# EAGLE design untitled (EAGLE 9.6.2)
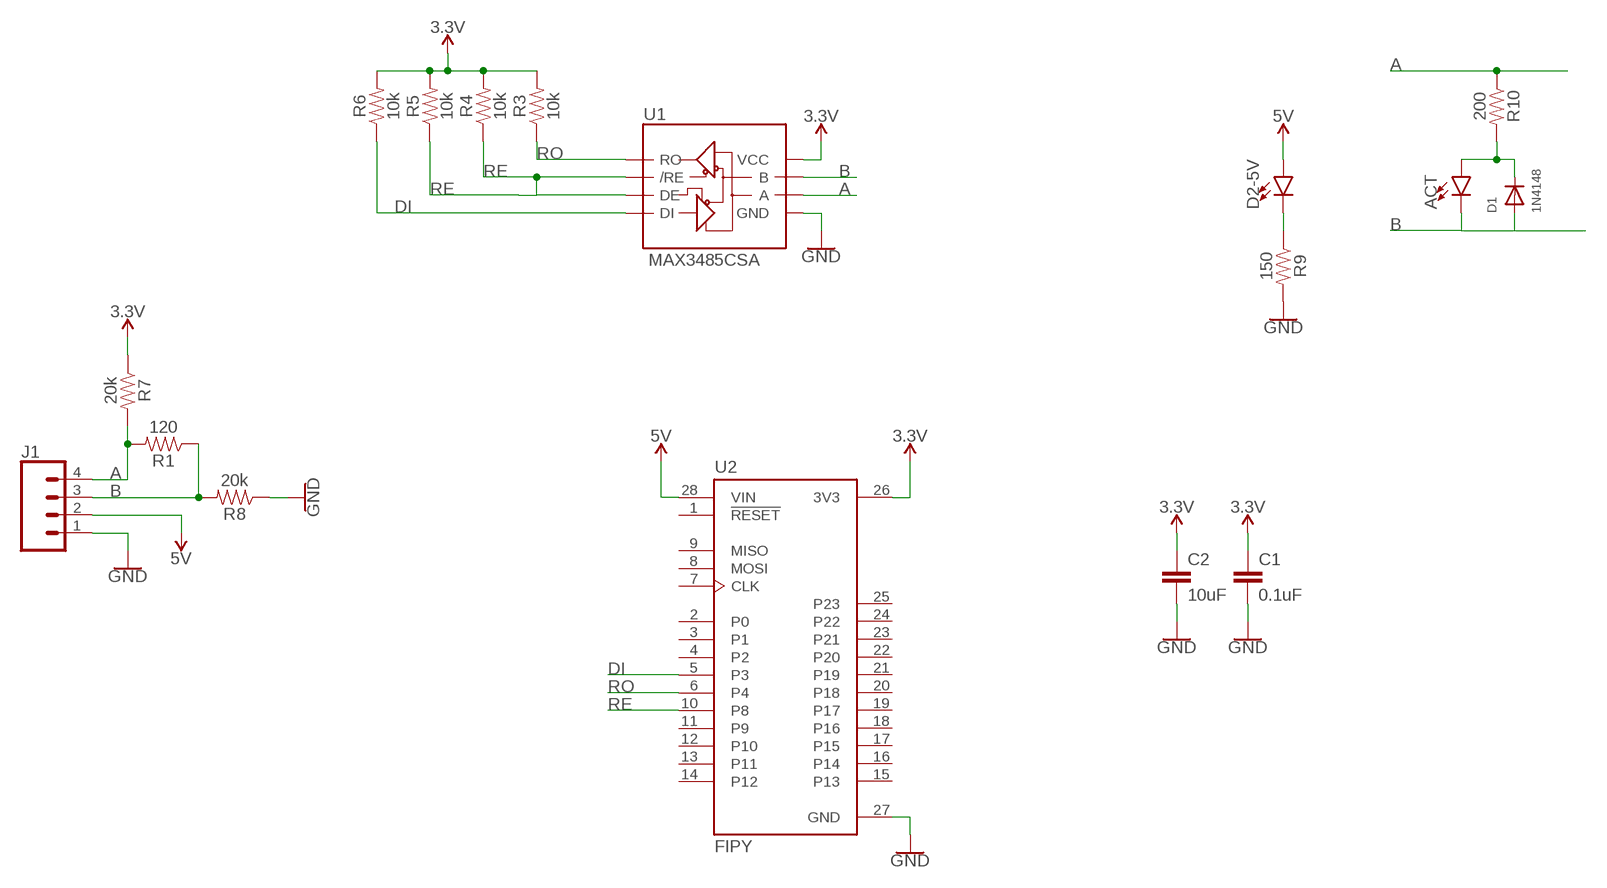
[diagram p0: schematic, sheet 1]

## Parts
ACT  LED0603  [LED-0603]
C1  0.1uF  0.1UF-0603-25V-5%  [0603]
C2  10uF  10UF-0603-6.3V-20%  [0603]
D1  1N4148  DIODESOD-123  [SOD-123]
D2-5V  LED0603  [LED-0603]
J1  CONN_04LOCK_LONGPADS  [1X04_LOCK_LONGPADS]
R1  120  0.3OHM-0805-1/8W-1%  [0805]
R3  10k  10KOHM-0603-1/10W-1%  [0603]
R4  10k  10KOHM-0603-1/10W-1%  [0603]
R5  10k  10KOHM-0603-1/10W-1%  [0603]
R6  10k  10KOHM-0603-1/10W-1%  [0603]
R7  20k  0.3OHM-0805-1/8W-1%  [0805]
R8  20k  0.3OHM-0805-1/8W-1%  [0805]
R9  150  0.3OHM-0805-1/8W-1%  [0805]
R10  200  0.3OHM-0805-1/8W-1%  [0805]
U1  MAX3485CSA  RS485SOIC  [SO08]
U2  FIPY  [MODULE_FIPY]

## Nets
3.3V: C1.1 C2.1 R3.2 R4.2 R5.2 R6.2 R7.1 U1.8(VCC) U2.26(3V3)
5V: D2-5V.A J1.2 U2.28(VIN)
A: J1.4 R1.2 R7.2 R10.1 U1.6(A)
B: ACT.C D1.A J1.3 R1.1 R8.2 U1.7(B)
DI: R6.1 U1.4(DI) U2.5(P3)
GND: C1.2 C2.2 J1.1 R8.1 R9.2 U1.5(GND) U2.27(GND)
N$2: D2-5V.C R9.1
N$4: ACT.A D1.C R10.2
RE: R4.1 R5.1 U1.2(/RE) U1.3(DE) U2.10(P8)
RO: R3.1 U1.1(RO) U2.6(P4)
Unconnected: U2.1(!RESET) U2.2(P0) U2.3(P1) U2.4(P2) U2.7(CLK) U2.8(MOSI) U2.9(MISO) U2.11(P9) U2.12(P10) U2.13(P11) U2.14(P12) U2.15(P13) U2.16(P14) U2.17(P15) U2.18(P16) U2.19(P17) U2.20(P18) U2.21(P19) U2.22(P20) U2.23(P21) U2.24(P22) U2.25(P23)

## Library data of the parts
ACT D2-5V = SparkFun-LED:LED: LED (Generic) Standard schematic elements and footprints for 5mm, 3mm, 1206, and 0603 sized LEDs. Generic LEDs with no color specified.
C1 = SparkFun-Capacitors:0.1UF: 0.1µF ceramic capacitors A capacitor is a passive two-terminal electrical component used to store electrical energy temporarily in an electric field.; PROD_ID: CAP-08604
C2 = SparkFun-Capacitors:10UF: 10.0µF ceramic capacitors A capacitor is a passive two-terminal electrical component used to store electrical energy temporarily in an electric field.; PROD_ID: CAP-11015
D1 = adafruit:DIODE: Diode SMADIODE - SMA Surface Mount Package 20V 1A Schottky Diode Digikey: 641-1014-6-ND DO-1N4148 - Through Hole Small Current Diode SOD-123 20V 1 A (.5mV Vf) Schottky Diode - Digikey: MBRX120TPMSCT-ND SOD-323 10V 570mA (.38mV Vf, 3ns) Schottky Diode - Digikey: ZLLS410CT-ND SOD-523 30V 30mA Schottky Diode (RB751S-40TE61) - Digikey: RB751S-40TE61CT-ND SOT23-R/W - SOT23 Package (R = Solder Paste/Reflow Ovens, W = Hand-Soldering) BAT54Film 40V 300mA - Digikey: 497-7162-1-ND
J1 = SparkFun-Connectors:CONN_04: Multi connection point. Often used as Generic Header-pin footprint for 0.1 inch spaced/style header connections On any of the 0.1 inch spaced packages, you can populate with these: Break Away Headers - Straight <https://www.sparkfun.com/products/116> (PRT-00116) Break Away Male Headers - Right Angle <https://www.sparkfun.com/products/553> (PRT-00553) Female Headers <https://www.sparkfun.com/products/115> (PRT-00115) Break Away Headers - Machine Pin <https://www.sparkfun.com/products/117> (PRT-00117) Break Away Female Headers - Swiss Machine Pin <https://www.sparkfun.com/products/743> (PRT-00743) For SCREWTERMINALS and SPRING TERMINALS visit here: Screw Terimnals on SparkFun.com <https://www.sparkfun.com/search/results?term=Screw+Terminals> (5mm/3.5mm/2.54mm spacing) This device is also useful as a general connection point to wire up your design to another part of your project. Our various solder wires solder well into these plated through hole pads. Hook-Up Wire - Assortment (Stranded, 22 AWG) <https://www.sparkfun.com/products/11375> (PRT-11375) Hook-Up Wire - Assortment (Solid Core, 22 AWG) <https://www.sparkfun.com/products/11367> (PRT-11367) View the entire wire category on our website here <https://www.sparkfun.com/categories/141> Special notes: Molex polarized connector foot print use with SKU : PRT-08231 with associated crimp pins and housings. 1MM SMD Version SKU: PRT-10208; PROD_ID: CONN-09696
R1 R7-R10 = SparkFun-Resistors:0.3OHM: 0.3Ω resistor A resistor is a passive two-terminal electrical component that implements electrical resistance as a circuit element. Resistors act to reduce current flow, and, at the same time, act to lower voltage levels within circuits. - Wikipedia; PROD_ID: RES-11622; VALUE: 0.3
R3-R6 = SparkFun-Resistors:10KOHM: 10kΩ resistor A resistor is a passive two-terminal electrical component that implements electrical resistance as a circuit element. Resistors act to reduce current flow, and, at the same time, act to lower voltage levels within circuits. - Wikipedia; PROD_ID: RES-00824
U1 = SparkFun-IC-Comms:RS485: RS-485 Transceiver SP3485 Series 8 Pin NSOIC 3.3 V Low Power Half Duplex RS-485 Transceiver MAX3485 compatible Datasheet <http://www.sparkfun.com/datasheets/Components/General/sp3485CN-LTR.pdf> SparkFun Products SparkFun Transceiver Breakout - RS-485 <https://www.sparkfun.com/products/10124> (BOB-10124) SparkFun USB to RS-485 Converter <https://www.sparkfun.com/products/9822> (BOB-09822); PROD_ID: IC-09388
U2 = FIPY:FIPY: ESP32 - Transceiver; 802.11 b/g/n (Wi-Fi, WiFi, WLAN), Bluetooth® Smart Ready 4.x Dual Mode, LoRa® (LoRaWAN™), Sigfox Evaluation Board Check availability <https://pricing.snapeda.com/parts/FIPY/Pycom%20Ltd./view-part?ref=eda>; AVAILABILITY: In Stock; DESCRIPTION: ESP32 series Transceiver; 802.11 b/g/n (Wi-Fi, WiFi, WLAN), Bluetooth® Smart Ready 4.x Dual Mode, LoRa® (LoRaWAN™), Sigfox Evaluation Board; MF: Pycom Ltd.; MP: FIPY; PACKAGE: None; PRICE: None; PURCHASE-URL: https://pricing.snapeda.com/search/part/FIPY/?ref=eda

## Board
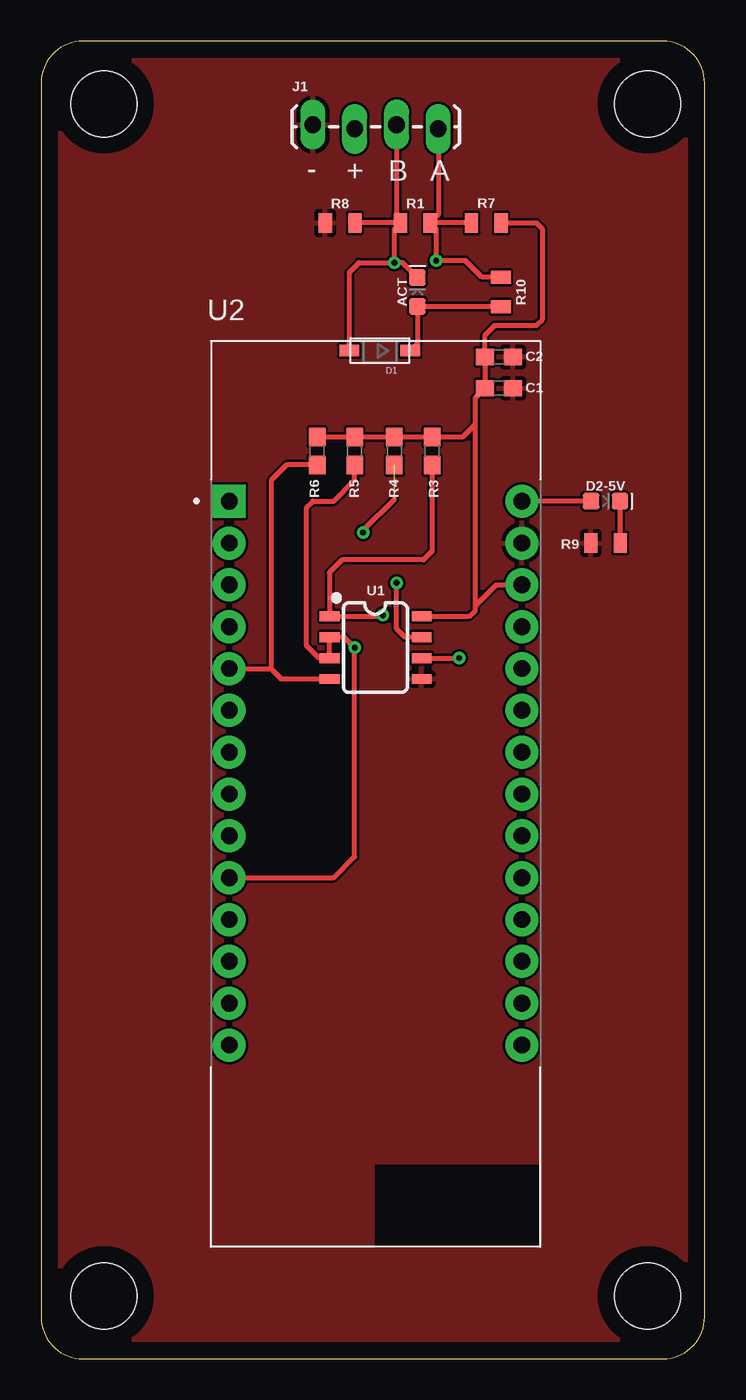
[diagram p1: board, top side]
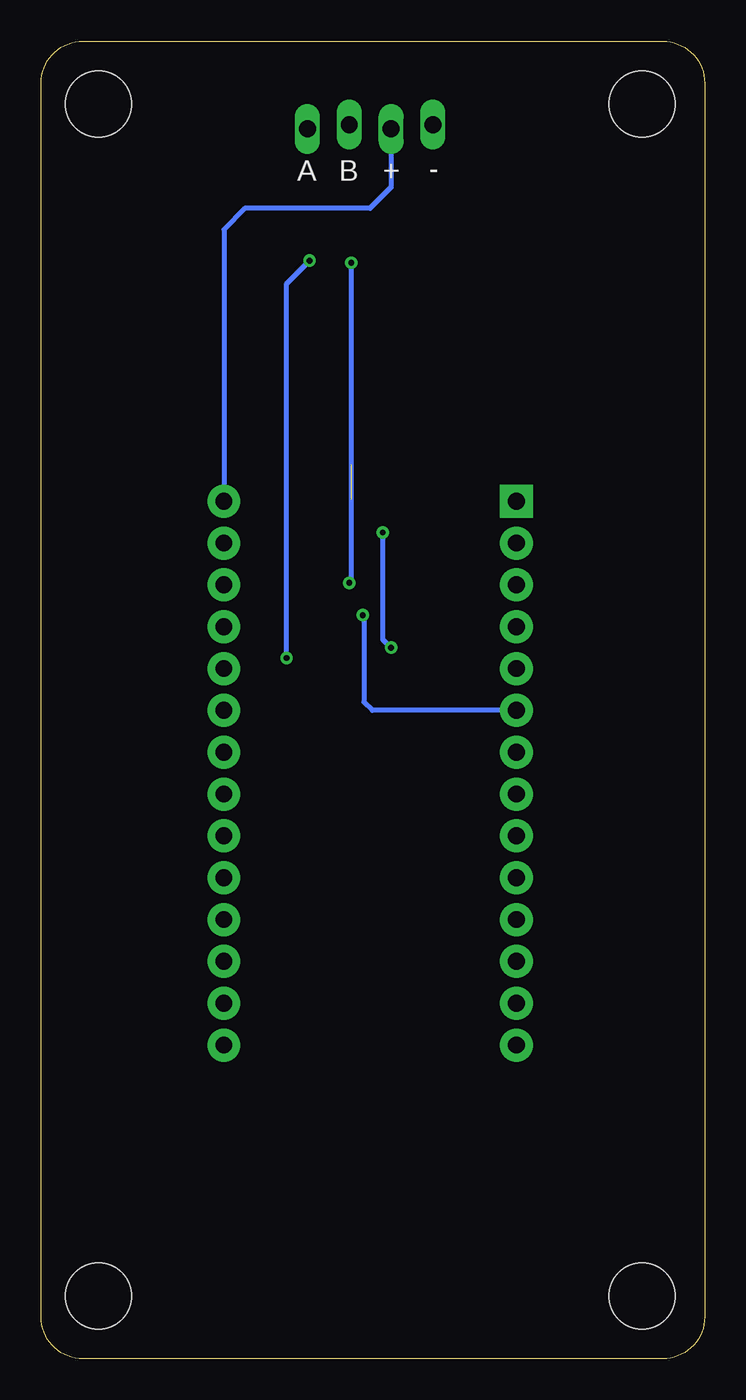
[diagram p2: board, bottom side, seen from below]

Size 40.31 x 80 mm. Coordinates in mm from the lower left corner, seen from the top.
Outline: 40.31,2.54 40.31,77.46 arc90 37.77,80 2.54,80 arc90 0,77.46 0,2.54 arc90 2.54,0 37.77,0 arc90 40.31,2.54
Copper layers (1*16): Top 0.035mm / dielectric 1.5mm / Bottom 0.035mm
Design rules "default": minimum track width 6mil, minimum drill 0.35mm, track to track 6mil, track to pad 6mil, pad to pad 6mil, via to via 6mil, smd to smd 6mil, copper to edge 40mil, drill to drill 6mil, minimum pad ring 10mil, minimum via ring 8mil, stop-mask expansion 4mil, vias tented up to drill 0mil, thermal gap 10mil
Holes 4 mm at 3.81,76.2 36.83,76.2 3.81,3.81 36.83,3.81

### Footprints (pad centres in the part's own frame; a part is rotated, then mirrored left to right if it is on the bottom)
LED-0603 = smd 1 x 1: A -0.877,0; C 0.877,0
0603 = smd 1.1 x 1: 1 -0.85,0; 2 0.85,0
SOD-123 = smd 1.2 x 0.7: A 1.85,0; C -1.85,0
1X04_LOCK_LONGPADS = drill 1.016 long: 1 0,0; 2 2.54,-0.254; 3 5.08,0; 4 7.62,-0.254
0805 = smd 0.8 x 1.2: 1 -0.9,0; 2 0.9,0
SO08 = smd 0.6 x 1.2: 1 -1.905,-2.8; 2 -0.635,-2.8; 3 0.635,-2.8; 4 1.905,-2.8; 5 1.905,2.8; 6 0.635,2.8; 7 -0.635,2.8; 8 -1.905,2.8
MODULE_FIPY = drill 1.02 pad 2 square: 1 -8.89,17.78 | drill 1.02 pad 2: 2 -8.89,15.24; 3 -8.89,12.7; 4 -8.89,10.16; 5 -8.89,7.62; 6 -8.89,5.08; 7 -8.89,2.54; 8 -8.89,0; 9 -8.89,-2.54; 10 -8.89,-5.08; 11 -8.89,-7.62; 12 -8.89,-10.16; 13 -8.89,-12.7; 14 -8.89,-15.24; 15 8.89,-15.24; 16 8.89,-12.7; 17 8.89,-10.16; 18 8.89,-7.62; 19 8.89,-5.08; 20 8.89,-2.54; 21 8.89,0; 22 8.89,2.54; 23 8.89,5.08; 24 8.89,7.62; 25 8.89,10.16; 26 8.89,12.7; 27 8.89,15.24; 28 8.89,17.78

### Placement (x,y rotation side)
ACT  22.86,64.77 90 top
C1  27.81,58.93 0 top
C2  27.81,60.83 0 top
D1  20.57,61.21 180 top
D2-5V  34.29,52.07 0 top
J1  16.51,74.93 0 top
R1  22.73,68.96 0 top
R3  23.75,55.12 90 top
R4  21.46,55.12 90 top
R5  19.05,55.12 90 top
R6  16.76,55.12 90 top
R7  27.05,68.96 180 top
R8  18.16,68.96 0 top
R9  34.29,49.53 180 top
R10  27.94,64.77 270 top
U1  20.32,43.18 270 top
U2  20.32,34.29 0 top

### Tracks (layer width: path | path; a pad name or v marks a point on that pad's centre or on a via)
3.3V
  Top 0.305: R6.2 R5.2 R4.2 R3.2 | R3.2 23.84,55.88 | U1.8 26.04,45.09 26.38,45.43 26.38,45.72 | R3.2 25.61,55.97 26.38,56.73 | R7.1 30.11,68.95 30.48,68.58 30.48,63.12 30.1,62.74 27.56,62.74 26.96,62.14 C2.1 C1.1 26.38,58.34 26.38,56.73 | 26.38,45.72 26.38,56.73 | 26.38,45.72 27.65,46.99 U2.26
5V
  Top 0.305: D2-5V.A U2.28
  Bottom 0.305: J1.2 19.05,71.12 20.32,69.85 27.94,69.85 29.21,68.58 U2.28
A  (via drill 0.35)
  Top 0.305: J1.4 24.13,69.46 R1.2 | R1.2 24,68.59 v24,66.67 25.78,66.67 26.79,65.67 R10.1 | R7.2 R1.2 | U1.6 v25.4,42.55
  Bottom 0.305: v25.4,42.55 25.4,65.28 v24,66.67
B  (via drill 0.35)
  Top 0.305: J1.3 21.59,69.2 R1.1 | v21.46,66.55 21.46,68.59 R1.1 | R1.1 R8.2 | U1.7 22.1,43.81 21.59,44.32 v21.59,47.12 | D1.A 18.72,65.97 19.3,66.55 v21.46,66.55 | ACT.C 21.96,66.55 v21.46,66.55
  Bottom 0.305: v21.59,47.12 21.46,47.24 v21.46,66.55
DI
  Top 0.305: U1.4 14.61,41.27 13.97,41.91 | U2.5 13.97,41.91 | R6.1 14.9,54.27 13.97,53.34 13.97,41.91
GND
  pour Top: 38.1,0 2.54,0 arc-90 0,2.54 0,77.47 arc-90 2.54,80.01 38.1,80.01 arc-90 40.64,77.47 40.64,2.54 arc-90
N$2
  Top 0.305: R9.1 35.19,52.05 D2-5V.C
N$4
  Top 0.305: R10.2 27.92,63.89 ACT.A 22.86,61.65 D1.C
RE  (via drill 0.35)  (1 unrouted)
  Top 0.305: U2.10 17.78,29.21 19.05,30.48 v19.05,43.18 18.41,43.81 U1.2 U1.3 16.89,42.55 16.13,43.31 16.13,51.69 16.51,52.07 17.78,52.07 19.05,53.34 R5.1 | 21.46,52.2 19.56,50.29 v19.56,50.16
  Bottom 0.305: v19.56,50.16 19.56,43.69 v19.05,43.18
RO  (via drill 0.35)
  Top 0.305: v20.77,45.15 20.7,45.09 U1.1 17.52,47.75 18.29,48.51 23.24,48.51 23.75,49.02 R3.1
  Bottom 0.305: U2.6 20.19,39.37 20.7,39.88 20.7,45.09 v20.77,45.15

### Text on the board
tNames: - | + | B | A
bNames: - | + | B | A